# EasyEDA Pro project ProPrj_Proj_mamba_2026-03-26.epro, board PCB1
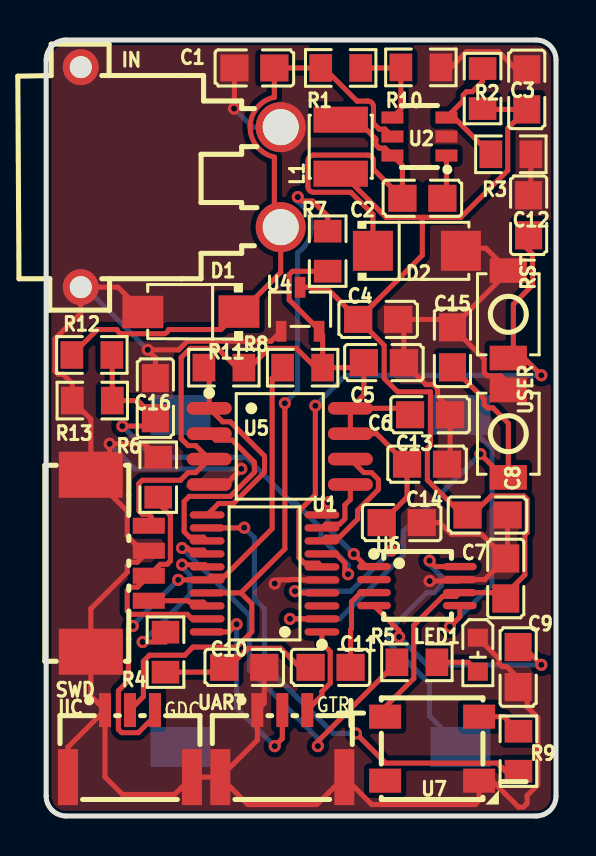
[diagram p2: board, top side]
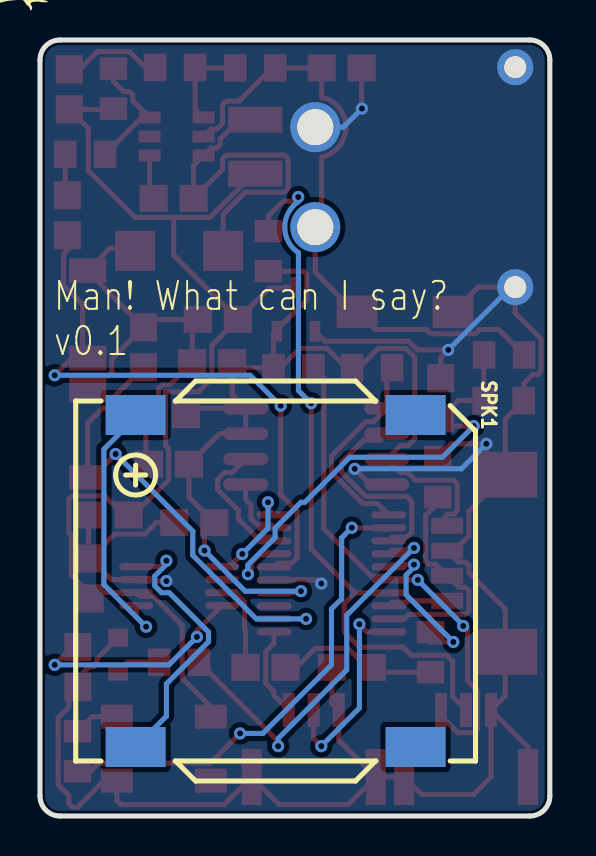
[diagram p3: board, bottom side, seen from below]

Outline 25.5 x 38.8 mm; copper layers: Top Layer, Bottom Layer. Coordinates in mm from the lower left corner of the outline.
Outline path: 0,37.8 0,1 arc(0.29,0.29) 1,0 24.5,0 arc(25.21,0.29) 25.5,1 25.5,37.8 arc(25.21,38.51) 24.5,38.8 1,38.8 arc(0.29,38.51) 0,37.8
Stack: Top Layer 0.035mm / Dielectric1 1.51mm FR4 er 4.5 / Bottom Layer 0.035mm

## Design rules (mm)
spacing copperThickness1oz (default): track to track 0.102, other pairs 0.152 to 0.3
spacing copperThickness2oz: track to track 0.203, other pairs 0.152 to 0.3
track width copperThickness1oz (default): min 0.127, default 0.254, max 2.54
track width copperThickness2oz: min 0.203, default 0.254, max 2.54
differential pair differentialPair (default): width min 0.127, default 0.254, max 2.54; gap min 0.152, default 0.152

## Placement (name value [footprint] x y rotation side)
C1  4.7uF  [C0805]  10.41 37.4 180 top
C2  100nF  [C0805]  18.82 30.89 180 top
C3  10uF  [C0805]  24.04 36.33 270 top
C4  1uF  [C0805]  16.61 24.83 180 top
C5  1uF  [C0805]  16.89 22.67 180 top
C6  100nF  [C0805]  19.2 20.06 180 top
C7  10uF  [C0805]  22.99 11.88 270 top
C8  1uF  [C0805]  22.08 15.05 180 top
C9  100nF  [C0805]  23.61 7.45 90 top
C10  10nF  [C0805]  9.91 7.43 0 top
C11  100nF  [C0805]  14.22 7.43 0 top
C12  100nF  [C0805]  24.13 30.04 270 top
C13  100nF  [C0805]  19.05 17.59 180 top
C14  4.7uF  [C0805]  17.78 14.67 180 top
C15  100nF  [C0805]  20.32 23.43 270 top
C16  10nF  [C0805]  5.46 20.89 270 top
D1  SMAJ33A  [SMA_L4.3-W2.6-LS5.0-RD]  7.24 25.21 180 top
D2  SS14  [SMA_L4.3-W2.6-LS5.2-RD]  18.54 28.26 0 top
IIC  WAFER-GH1.25-3PLB  [CONN-SMD_3P-P1.25_XUNPU_WAFER-GH1.25-3PLB]  4.19 3.62 0 top
IN  XT30PW-M30.G.Y  [CONN-TH_XT30PW-M]  6.73 31.94 270 top
L1  22uH  [IND-SMD_L3.0-W3.0_FNR30XXS]  14.73 33.47 90 top
LED1  GL0603UR01  [LED0603-FD]  21.59 8.07 90 top
R1  100kΩ  [R0805]  14.73 37.4 180 top
R2  124kΩ  [R0805]  21.83 36.37 90 top
R3  23.7kΩ  [R0805]  23.24 33.09 180 top
R4  1kΩ  [R0805]  5.97 8.19 270 top
R5  1kΩ  [R0805]  18.54 7.69 0 top
R6  10kΩ  [R0805]  5.6 16.94 90 top
R7  4.7kΩ  [R0805]  14.08 28.24 270 top
R8  4.7kΩ  [R0805]  12.83 22.42 0 top
R9  100Ω  [R0805]  23.62 3.24 270 top
R10  10kΩ  [R0805]  18.74 37.43 180 top
R11  10kΩ  [R0805]  8.89 22.42 180 top
R12  100kΩ  [R0805]  2.29 23.05 180 top
R13  10kΩ  [R0805]  2.31 20.77 180 top
RST  TS-1088-AR02016  [SW-SMD_L3.9-W3.0-P4.45]  23.11 25.08 270 top
SPK1  FS2045  [BUZ-SMD_4P-L20.0-W20.0_FS2045]  13.72 11.75 270 bottom
SWD  532610471  [CONN-SMD_4P-P1.25_53261-0471]  3.68 12.64 270 top
U1  STM32G030F6P6  [TSSOP-20_L6.5-W4.4-P0.65-LS6.4-BL]  10.92 12.13 90 top
U2  MP2459GJ-Z  [SOT-23-6_L2.9-W1.6-P0.95-LS2.8-BR]  18.67 33.97 0 top
U4  XC6206P332MR  [SOT-23-3_L3.0-W1.7-P0.95-LS2.9-BR]  12.7 25.34 270 top
U5  W25Q32JVSSIQ  [SOIC-8_L5.3-W5.3-P1.27-LS8.0-BL]  11.68 18.48 270 top
U6  PAM8302AASCR  [MSOP-8_L3.0-W3.0-P0.65-LS5.0-BL]  18.54 11.5 270 top
U7  WS2812  [LED-SMD_4P-L5.0-W5.0-TL-A]  19.3 3.37 0 top
UART  WAFER-GH1.25-3PLB  [CONN-SMD_3P-P1.25_XUNPU_WAFER-GH1.25-3PLB]  11.81 3.62 0 top
USER  TS-1088-AR02016  [SW-SMD_L3.9-W3.0-P4.45]  23.11 19.12 270 top

## Footprints (pads in the part's own frame, mm; a bottom-side part is the same pattern mirrored in y, then rotated)
BUZ-SMD_4P-L20.0-W20.0_FS2045
  rect 2x3 smd: 1(-8.3,-7) 2(8.3,-7) 3(8.3,7) 4(-8.3,7)
C0805
  rect 1.41x1.35 smd: 1(-1,0) 2(1,0)
CONN-SMD_3P-P1.25_XUNPU_WAFER-GH1.25-3PLB
  rect 0.6x1.7 smd: 1(-1.25,1.675) 2(0.001,1.675) 3(1.25,1.675)
  rect 1x2.8 smd: 4(3.1,-1.675) 5(-3.1,-1.675)
CONN-SMD_4P-P1.25_53261-0471
  rect 0.8x1.6 smd: 1(-1.875,1.45) 2(-0.625,1.45) 3(0.625,1.45) 4(1.875,1.45)
  rect 2.3x3.2 smd: 5(4.425,-1.45) 6(-4.425,-1.45)
CONN-TH_XT30PW-M
  round 2.5 hole 1.8: 1(-2.5,5) 2(2.5,5)
  round 1.8 hole 1.1: 3(5.5,-5) 4(-5.5,-5)
IND-SMD_L3.0-W3.0_FNR30XXS
  rect 1.3x2.72 smd: 1(1.35,0) 2(-1.35,0)
LED0603-FD
  rect 0.9x1 smd: 1(-0.85,0) 2(0.85,0)
LED-SMD_4P-L5.0-W5.0-TL-A
  rect 1.6x1.2 smd: 1(-2.35,1.6) 2(-2.35,-1.6) 3(2.35,-1.6) 4(2.35,1.6)
MSOP-8_L3.0-W3.0-P0.65-LS5.0-BL
  oval 0.364x1.692 smd: 1(-0.975,-2.146) 2(-0.325,-2.146) 3(0.325,-2.146) 4(0.975,-2.146) 5(0.975,2.146) 6(0.325,2.146) 7(-0.325,2.146) 8(-0.975,2.146)
R0805
  rect 1.133x1.377 smd: 1(-1,0) 2(1,0)
SMA_L4.3-W2.6-LS5.0-RD
  rect 2.046x1.62 smd: 1(-2.404,-0.009) 2(2.404,0.009)
SMA_L4.3-W2.6-LS5.2-RD
  rect 2x2 smd: 1(-2.2,0) 2(2.2,0)
SOIC-8_L5.3-W5.3-P1.27-LS8.0-BL
  oval 0.63x2.25 smd: 1(-1.905,-3.53) 2(-0.635,-3.53) 3(0.635,-3.53) 4(1.905,-3.53) 5(1.905,3.53) 6(0.635,3.53) 7(-0.635,3.53) 8(-1.905,3.53)
SOT-23-3_L3.0-W1.7-P0.95-LS2.9-BR
  rect 1.038x0.532 smd: 1(1.101,-0.95) 2(1.101,0.95) 3(-1.101,0)
SOT-23-6_L2.9-W1.6-P0.95-LS2.8-BR
  rect 1.1x0.6 smd: 1(1.35,-0.95) 2(1.35,0) 3(1.35,0.95) 4(-1.35,0.95) 5(-1.35,0) 6(-1.35,-0.95)
SW-SMD_L3.9-W3.0-P4.45
  rect 1.23x1.86 smd: 1(-2.185,0) 2(2.185,0)
TSSOP-20_L6.5-W4.4-P0.65-LS6.4-BL
  oval 0.364x1.742 smd: 1(-2.925,-2.871) 2(-2.275,-2.871) 3(-1.625,-2.871) 4(-0.975,-2.871) 5(-0.325,-2.871) 6(0.325,-2.871) 7(0.975,-2.871) 8(1.625,-2.871) 9(2.275,-2.871) 10(2.925,-2.871) 11(2.925,2.871) 12(2.275,2.871) 13(1.625,2.871) 14(0.975,2.871) 15(0.325,2.871) 16(-0.325,2.871) 17(-0.975,2.871) 18(-1.625,2.871) 19(-2.275,2.871) 20(-2.925,2.871)

## Nets
As in the schematic.

Pads without a net: SPK1 3 4; U1 3; U6 2; U7 2

## Via types
v1: diameter 0.61, hole 0.305, Top Layer to Bottom Layer, 32 vias

## Routing (per net, layer and track width the routed paths; a pad name or vN(x,y) marks a point on that pad's centre or on a via; arc(x,y) is an arc through that point)
3V3: length 53
  Top Layer w0.254: C6.2 17.88,20.39 U5.8 ; 5.26,14.51 5.26,14.95 5.12,15.09 4.8,15.09 4.64,15.26 4.64,16.62 4.8,16.79 6.71,16.79 7.1,17.17 7.48,17.17 U5.3 7.48,18.52 7.1,18.52 6.75,18.87 6.75,22.93 7.21,23.38 8.57,23.38 9.54,22.42 R11.1 10.18,22.42 11.15,23.38 12.51,23.38 13.48,22.42 R8.2 ; U5.8 15.89,21.06 C5.2 15.64,22.42 R8.2 ; U5.8 U5.7 16.53,19.12 C13.2 18.05,15.94 C14.2 17.27,14.18 v1(17.27,13.27) ; R8.2 13.83,24.06 U4.2 13.65,24.31 12.16,25.81 12.16,27.07 12.32,27.24 14.08,27.24 R7.2 ; v1(12.45,11.24) 12.53,11.16 13.79,11.16
  Bottom Layer w0.254: v1(12.45,11.24) 15.24,11.24 v1(17.27,13.27)
5V: length 58.6
  Top Layer w0.254: L1.2 14.81,32.12 17,29.93 18.81,29.93 ; C4.2 16.91,23.53 16.91,21.88 17.58,21.21 19.22,21.21 19.22,18.53 19.07,18.38 19.07,16.8 19.8,16.07 19.81,16.07 20.83,15.05 C8.2 21.3,15.05 22.25,16 23.9,16 24.06,15.84 24.06,14.17 23.94,14.05 23.94,12.06 22.99,11.1 C7.2 22.69,11.17 U6.6 20.5,10.98 19.83,10.98 18.39,9.54 18.39,6.88 16.95,5.45 U7.1 ; C4.2 14.04,26.4 13.28,26.4 13.24,26.44 U4.3 ; C4.2 18.81,28.04 18.81,29.93 ; 18.81,29.93 20.74,29.93 23.09,32.28 23.09,34.38 C3.2 21.87,35.33 R2.1
24V: length 31.8
  Top Layer w0.254: R12.2 2.56,24.32 3.54,24.32 arc(3.64,24.17) 3.81,24.11 5.86,24.11 arc(6.03,24.17) 6.13,24.32 8.74,24.32 D1.1 ; U2.5 16.95,34.34 16.65,34.34 16.37,34.63 16.37,35.47 arc(16.29,35.66) 16.09,35.75 15.55,35.75 13.89,37.4 R1.2 C1.1 11.41,35.94 arc(10.54,35.4) 10.2,34.44 arc(10.54,33.48) 11.41,32.95 11.41,29.76 IN.2 11.73,27.18 9.64,25.09
GND: length 153.8
  Top Layer w0.254: C1.2 9.41,35.39 v1(9.4,35.37) ; v1(9.76,17.36) 8.98,16.58 U5.4 ; C15.1 19.92,24.83 C4.1 17.89,24.54 C5.1 19,21.57 19.37,21.57 19.57,21.36 19.57,20.99 20.2,20.36 C6.1 20.2,17.74 C13.1 ; C15.1 23.11,27.23 RST.1 22,28.39 20.87,28.39 ; C15.1 21.91,22.85 21.91,22.17 22.07,22.01 22.75,22.01 23.11,21.64 USER.1 ; IIC.5 1.09,3.45 IIC.1 ; UART.5 10.08,0.57 13.54,0.57 UART.4 16.28,0.57 21.46,0.57 21.65,0.76 U7.3 22.3,1.77 23.62,0.45 23.88,0.45 24.06,0.63 24.06,1.02 24.59,1.56 24.59,4.92 24.06,5.46 24.06,6 C9.1 23.61,6.9 23.04,7.46 22.82,7.46 22.65,7.63 22.65,7.85 LED1.2 ; UART.5 IIC.4 6.43,1.08 3.81,1.08 2.94,1.95 IIC.1 ; UART.5 10.56,3.8 UART.1 10.91,5.64 C10.2 ; U1.5 12.71,11.81 12.69,11.83 12.2,11.83 12.18,11.81 11.61,11.81 v1(11.43,11.62) ; SWD.6 3.18,18.01 v1(3.18,18.61) 4.94,18.61 R6.2 ; SWD.6 4.05,15.24 4.05,14 4.79,13.26 SWD.2 4.56,12.69 4.22,12.69 4.05,12.53 4.05,12.18 2.23,10.36 SWD.5 2.23,6 IIC.1 ; SWD.6 2.23,19.84 R13.2 1.31,21.62 0.84,22.08 0.6,22.08 0.44,22.25 0.44,23.86 1.73,25.15 IN.3 3.59,26.44 D1.2 ; C7.1 23.08,12.96 C8.1 ; C7.1 21.77,14.09 20.25,14.09 19.68,14.67 C14.1 ; C7.1 21.93,11.82 U6.7 20.62,11.75 v1(19.18,11.75) ; U4.1 11.25,23.74 7.06,23.74 6.63,23.31 v1(5.08,23.31) 5.46,22.92 C16.1 ; R10.1 20.24,37.43 21.02,38.22 22.63,38.22 23.42,37.43 23.94,37.43 C3.1 ; R3.1 24.24,31.15 C12.1
  Bottom Layer w0.254: IN.1 10.33,34.44 v1(9.4,35.37) ; IN.3 1.94,26.44 v1(5.08,23.31) ; v1(9.76,17.36) 4.43,17.36 v1(3.18,18.61)
ADC: length 23.5
  Top Layer w0.254: v1(15.1,12.09) 14.94,12.25 14.94,12.65 14.48,13.11 U1.7 ; v1(3.81,19.5) 5.06,19.5 C16.2 4.58,20.77 R13.1 3.31,23.03 R12.1
  Bottom Layer w0.254: v1(3.81,19.5) 5.37,17.94 10,17.94 12.26,15.69 12.45,15.69 13.74,14.39 13.74,13.92 15.1,12.56 v1(15.1,12.09)
AMP_SHDN: length 4.8
  Top Layer w0.254: U1.10 14.1,15.36 v1(14.1,15.69) ; 16.02,12.47 v1(15.39,13.1)
  Bottom Layer w0.254: v1(14.1,15.69) 14.1,14.39 v1(15.39,13.1)
CLK: length 11.4
  Top Layer w0.254: U1.19 7.29,9.86 7.06,10.08 4.22,10.08 4.05,10.25 4.05,11.28 4.22,11.44 4.56,11.44 SWD.3 5.7,12.58 6.05,12.58 6.21,12.75 6.21,15.03 5.6,15.64 R6.1
DIO: length 3
  Top Layer w0.254: SWD.4 7.1,10.76 7.17,10.69 7.86,10.69 U1.18
FLASH_CS: length 10.5
  Top Layer w0.254: R11.2 8.15,22.15 U5.1 8.83,19.71 9.21,19.71 10.92,18 10.92,17.19 9.36,15.62 8.62,15.62 U1.11
PWM: length 8.1
  Top Layer w0.254: 8.05,12.45 7.94,12.57 v1(6.8,12.57) ; R4.1 6.11,9.05 6.11,8.84 5.97,8.7 v1(4.83,8.7)
  Bottom Layer w0.254: v1(4.83,8.7) 7.19,11.06 7.19,12.05 6.8,12.44 v1(6.8,12.57)
RX: length 4.6
  Top Layer w0.254: UART.3 13.79,6.03 13.79,6.23 14.21,6.64 14.21,8.22 13.79,8.64 U1.1
SCL: length 25.3
  Top Layer w0.254: v1(6.6,11.81) U1.16 8.24,11.99 8.93,11.99 11.3,14.37 11.3,21.89 R8.1 ; IIC.3 5.44,5 4.61,4.17 3.78,4.17 3.61,4.33 3.61,6.26 4.11,6.76 4.11,9.31 4.33,9.54
  Bottom Layer w0.254: v1(6.6,11.81) 4.33,9.54
  vias: v1(4.33,9.5)
SDA: length 36.7
  Top Layer w0.254: IIC.2 4.86,5.97 4.86,7.74 5.17,8.04 6.93,8.04 7.34,8.45 9.53,8.45 10.29,9.21 10.29,10.61 9.74,11.16 ; R7.1 14.08,29.99 13.33,30.75 12.79,30.75 v1(12.59,30.95) ; 8.05,11.16 9.74,11.16 ; 9.74,11.16 11.94,13.36 v1(11.94,20.64)
  Bottom Layer w0.254: v1(11.94,20.64) 12.57,21.27 12.57,28.17 arc(13.08,28.72) 13.26,29.44 arc(13.08,30.17) 12.57,30.72 12.59,30.73 v1(12.59,30.95)
SPI1_MISO: length 10.3
  Top Layer w0.254: U5.2 8.47,18.8 9.3,18.8 10.41,17.69 10.41,17.19 9.21,15.98 7.16,15.98 6.9,15.73 6.9,14.21 7.17,13.94 7.86,13.94 U1.13
SPI1_MOSI: length 3.2
  Top Layer w0.254: U1.9 13.98,14.59 14.67,14.59 14.94,14.86 14.94,15.56 15.21,15.83 U5.5
SPI1_SCK: length 6.5
  Top Layer w0.254: U1.8 13.98,13.94 14.67,13.94 15.58,14.85 15.58,15.29 16.62,16.33 16.62,16.82 16.27,17.17 15.89,17.17 U5.6
TX: length 10.5
  Top Layer w0.254: U1.20 9.14,9.2 v1(9.53,9.59) ; UART.2 11.81,3.88 v1(11.43,3.49)
  Bottom Layer w0.254: v1(11.43,3.49) 9.53,5.4 v1(9.53,9.59)
WS2812: length 24
  Top Layer w0.254: R9.2 22.98,2.24 22.57,2.65 16.98,2.65 v1(15.49,4.13) ; v1(9.91,14.42) 9.9,14.41 U1.12
  Bottom Layer w0.254: v1(9.91,14.42) 10.41,13.91 10.41,10.86 10.92,10.35 10.92,7.56 14.35,4.13 v1(15.49,4.13)
$1N8: length 4.7
  Top Layer w0.254: R1.1 17.71,37.4 R10.2 17.74,35.35 U2.4
$1N12: length 18.9
  Top Layer w0.254: D2.1 16.34,30.08 15.24,31.19 13.37,31.19 arc(13.17,31.27) 13.09,31.47 13.09,32.77 arc(13.17,32.96) 13.37,33.05 16.09,33.05 arc(16.29,32.96) 16.37,32.77 16.37,32.33 C2.2 17.82,32.53 U2.6 16.95,33.4 16.65,33.4 16.49,33.56 16.49,33.85 15.53,34.82 L1.1
$1N14: length 2.2
  Top Layer w0.254: C2.1 20.02,31.09 U2.1
$1N17: length 6.3
  Top Layer w0.254: R3.2 20.4,34.92 U2.3 20.86,35.77 20.86,36.05 21.02,36.22 21.31,36.22 21.83,36.73 R2.2
$1N39: length 11.3
  Top Layer w0.254: v1(24.77,7.56) 23.88,8.45 C9.2 ; v1(17.65,8.95) 17.65,9.26 U6.4
  Bottom Layer w0.254: v1(17.65,8.95) 19.05,7.56 v1(24.77,7.56)
$1N40: length 13.4
  Top Layer w0.254: U6.5 20.69,9.96 v1(20.19,9.46)
  Bottom Layer w0.254: v1(20.19,9.46) 22.3,11.57 22.3,18.34 20.72,19.93 SPK1.1
$1N41: length 14
  Top Layer w0.254: v1(19.18,12.77) 19.47,12.47 U6.8
  Bottom Layer w0.254: v1(19.18,12.77) 19.18,12.58 19.76,11.99 19.76,11.51 19.42,11.17 19.04,11.17 17.07,9.2 17.07,8.71 19.18,6.61 19.18,4.99 SPK1.2
$1N45: length 8.1
  Top Layer w0.254: C11.1 12.68,7.43 11.73,8.39 10.09,8.39 9.13,7.43 C10.1 8.67,7.19 R4.2
$1N46: length 4.6
  Top Layer w0.254: C11.2 15.22,9.32 15.27,9.37 15.27,10.71 15.73,11.17 U6.3
$1N52: length 29.7
  Top Layer w0.254: v1(13.46,20.51) 13.46,16.06 12.64,15.25 12.64,12.91 12.91,12.64 13.6,12.64 13.79,12.45 ; v1(24.77,22.04) 23.9,22.9 RST.2 23.37,23.15 23.37,25.58 24.32,26.54 24.32,28.1 24,28.42 24,28.78
  Bottom Layer w0.254: v1(13.46,20.51) 14.99,22.04 v1(24.77,22.04)
$1N56: length 24
  Top Layer w0.254: U1.2 v1(12.19,9.86) ; C15.2 21.91,20.85 21.91,20.57 22.07,20.41 22.35,20.41 23.11,19.64 USER.2 22.89,16.93 v1(21.72,18.1)
  Bottom Layer w0.254: v1(12.19,9.86) 14.68,9.86 17.86,13.03 17.86,14.24 v1(21.72,18.1)
$1N70: length 19.9
  Top Layer w0.254: v1(13.59,3.49) 13.59,3.73 R5.1 ; U1.14 7.86,13.29 7.17,13.29 7.06,13.4 v1(6.8,13.4)
  Bottom Layer w0.254: v1(13.59,3.49) 13.59,3.88 10.16,7.3 10.16,10.04 v1(6.8,13.4)
$1N71: length 2.2
  Top Layer w0.254: LED1.1 21.12,7.69 R5.2
$1N80: length 2.3
  Top Layer w0.254: R9.1 22.9,4.97 U7.4

## Copper pours and planes (outline as drawn; the poured copper is in the pictures)
GND on Top Layer: -3.56,40.7 31.62,40.7 31.62,-3.87 -3.56,-3.87
GND on Bottom Layer: -4.32,41.72 31.75,41.72 31.75,-3.36 -4.32,-3.36

## Text on the board
Bottom Silkscreen Layer: Man! What can I say? / v0.1
Top Silkscreen Layer: GDC | GTR
